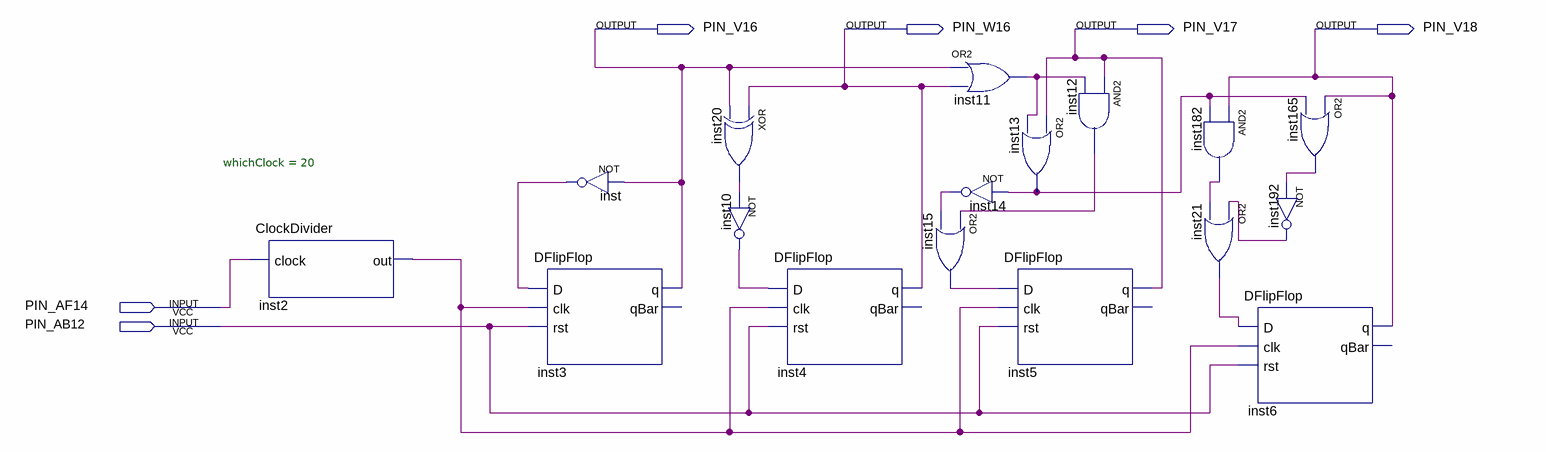
[diagram p0: schematic sheet]
// Quartus schematic DownCounterSchematic.bdf as structural Verilog: 17 symbols, 6 pins
module DownCounterSchematic (
  input  PIN_AF14,
  input  PIN_AB12,
  output PIN_V16,
  output PIN_W16,
  output PIN_V17,
  output PIN_V18
);

  wire inst2_out, inst10_out, inst11_out, inst12_out, inst13_out, inst14_out, inst15_out, inst20_out,
       inst21_out, inst165_out, inst182_out, inst192_out, inst_out;

  ClockDivider #(.whichClock(20)) inst2 (.clock(PIN_AF14), .out(inst2_out));
  DFlipFlop inst3 (.D(inst_out), .clk(inst2_out), .rst(PIN_AB12), .q(PIN_V16));  // open: qBar
  not inst (inst_out, PIN_V16);
  xor inst20 (inst20_out, PIN_W16, PIN_V16);
  not inst10 (inst10_out, inst20_out);
  DFlipFlop inst4 (.D(inst10_out), .clk(inst2_out), .rst(PIN_AB12), .q(PIN_W16));  // open: qBar
  or inst15 (inst15_out, inst12_out, inst14_out);
  or inst11 (inst11_out, PIN_V16, PIN_W16);
  or inst13 (inst13_out, PIN_V17, inst11_out);
  not inst14 (inst14_out, inst13_out);
  DFlipFlop inst5 (.D(inst15_out), .clk(inst2_out), .rst(PIN_AB12), .q(PIN_V17));  // open: qBar
  and inst12 (inst12_out, PIN_V17, inst11_out);
  and inst182 (inst182_out, PIN_V18, inst13_out);
  or inst21 (inst21_out, inst192_out, inst182_out);
  DFlipFlop inst6 (.D(inst21_out), .clk(inst2_out), .rst(PIN_AB12), .q(PIN_V18));  // open: qBar
  or inst165 (inst165_out, PIN_V18, inst13_out);
  not inst192 (inst192_out, inst165_out);
endmodule
